# EAGLE design vco1_components (EAGLE 7.6.0)
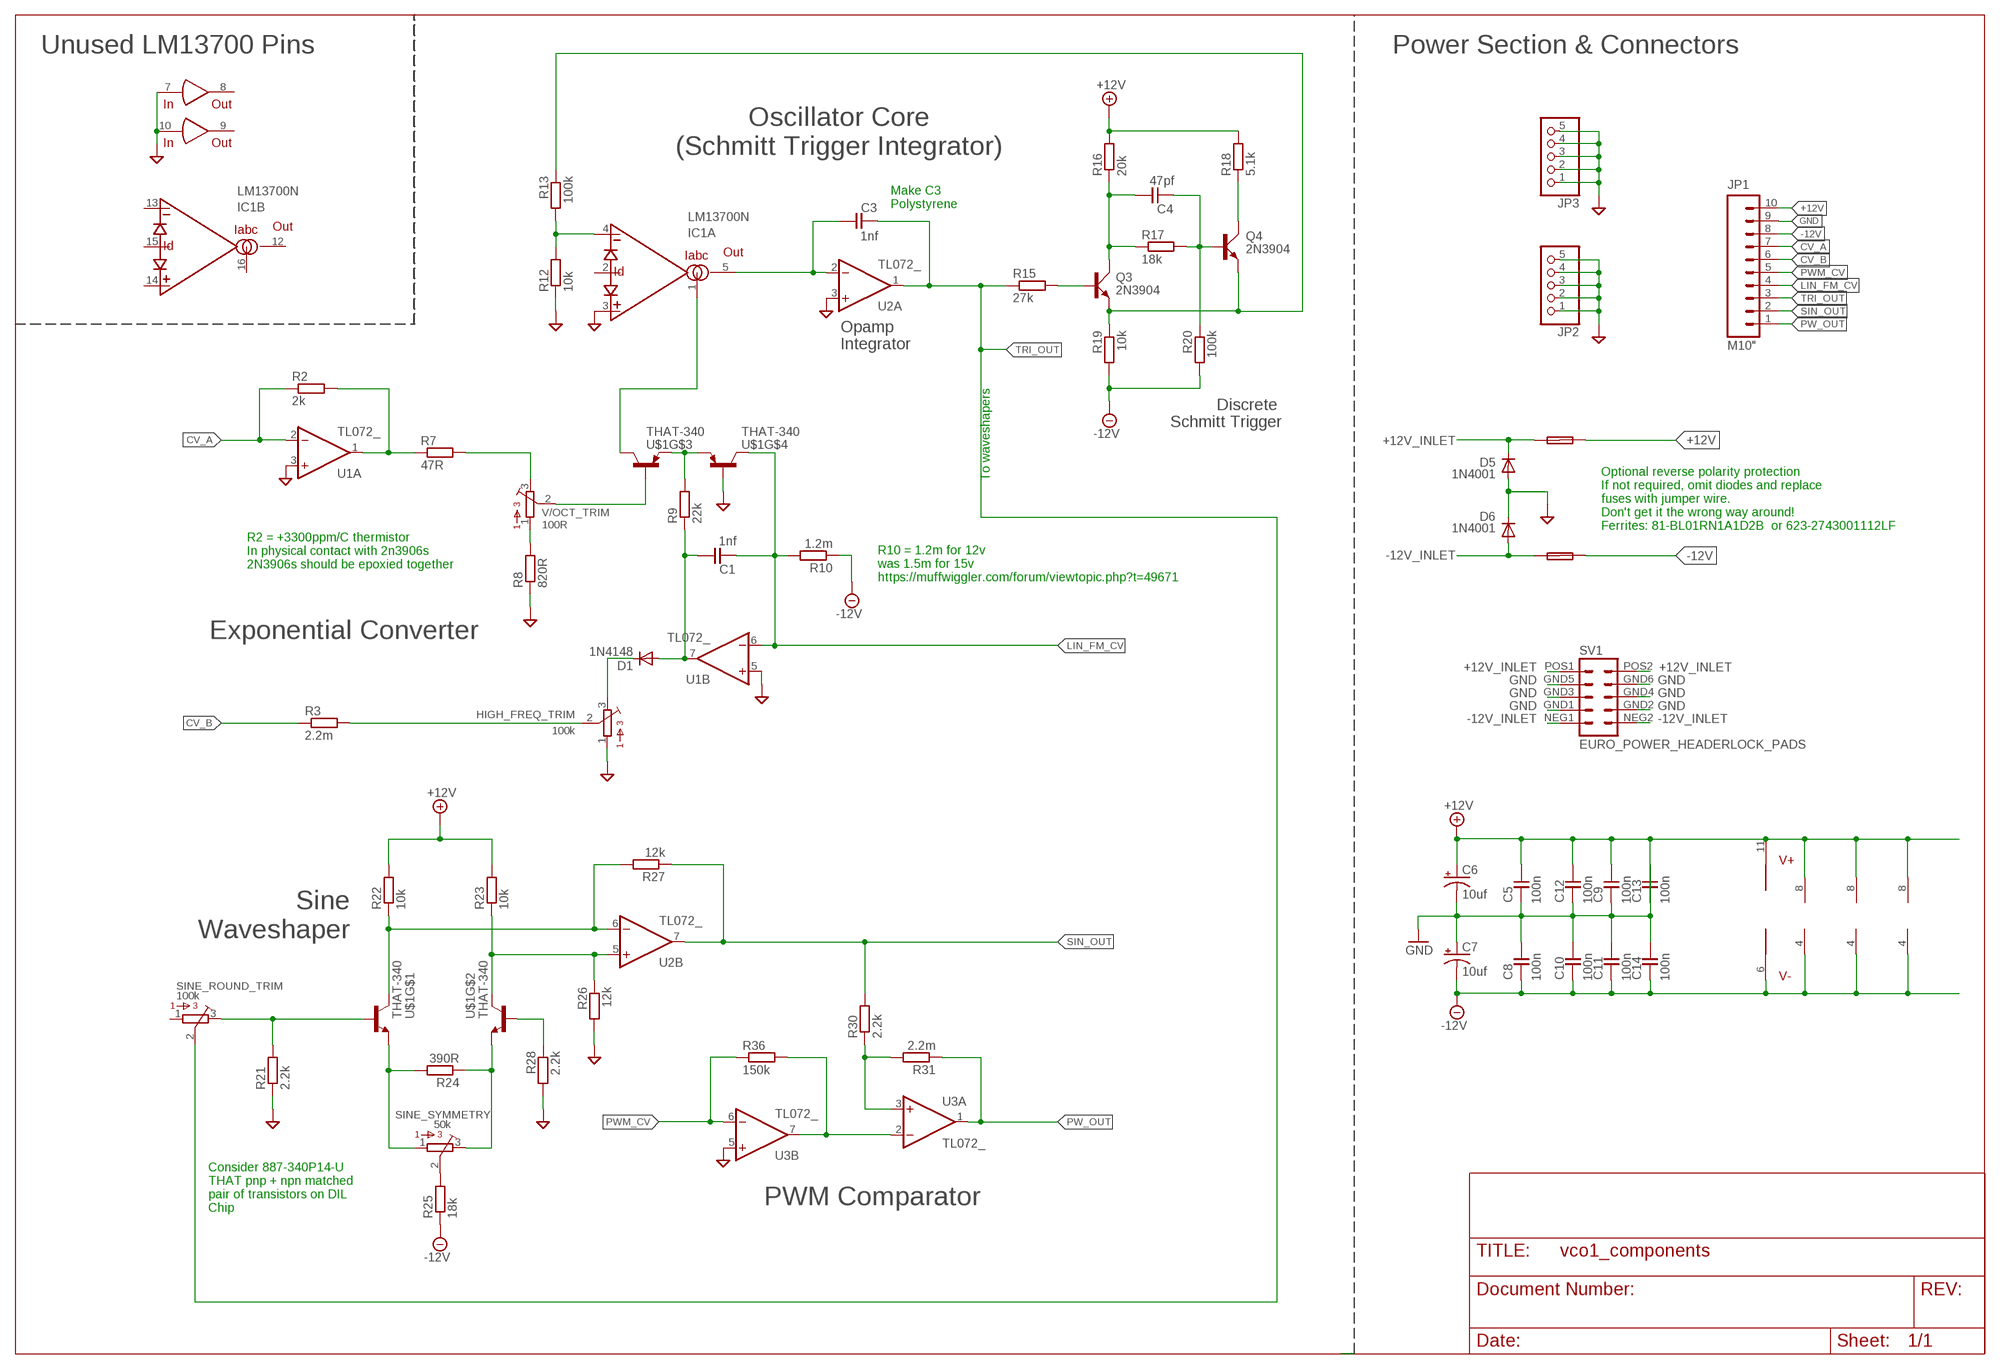
[diagram p0: schematic, sheet 1]

## Parts
C1  1nf  C-EU050-024X044  [C050-024X044]
C3  1nf  C-EU050-024X044  [C050-024X044]
C4  47pf  C-EU050-024X044  [C050-024X044]
C5  100n  C-EU050-024X044  [C050-024X044]
C6  10uf  CAP_POLPTH2  [CPOL-RADIAL-10UF-25V]
C7  10uf  CAP_POLPTH2  [CPOL-RADIAL-10UF-25V]
C8  100n  C-EU050-024X044  [C050-024X044]
C9  100n  C-EU050-024X044  [C050-024X044]
C10  100n  C-EU050-024X044  [C050-024X044]
C11  100n  C-EU050-024X044  [C050-024X044]
C12  100n  C-EU050-024X044  [C050-024X044]
C13  100n  C-EU050-024X044  [C050-024X044]
C14  100n  C-EU050-024X044  [C050-024X044]
D1  1N4148  SMALL_DIODEDO35-7  [DO35-7]
D5  1N4001  1N4004  [DO41-10]
D6  1N4001  1N4004  [DO41-10]
F1  FUSE  PTC_FUSEPOLY_FUSE  [C050H075X075]
F2  FUSE  PTC_FUSEPOLY_FUSE  [C050H075X075]
HIGH_FREQ_TRIM  100k  BOURNS_3362P_TRIMMERP  [BOURNS_3362P_TRIMMER]
IC1  LM13700N  [DIL16]
JP1  M10"  [1X10]
JP2  PINHD-1X55X2MM  [1_05X2MM]
JP3  PINHD-1X55X2MM  [1_05X2MM]
Q3  2N3904  [TO92D]
Q4  2N3904  [TO92D]
R2  2k  RESISTOR7MM  [7MM_RESISTOR]
R3  2.2m  RESISTOR7MM  [7MM_RESISTOR]
R7  47R  RESISTOR7MM  [7MM_RESISTOR]
R8  820R  RESISTOR7MM  [7MM_RESISTOR]
R9  22k  RESISTOR7MM  [7MM_RESISTOR]
R10  1.2m  RESISTOR7MM  [7MM_RESISTOR]
R12  10k  RESISTOR7MM  [7MM_RESISTOR]
R13  100k  RESISTOR7MM  [7MM_RESISTOR]
R15  27k  RESISTOR7MM  [7MM_RESISTOR]
R16  20k  RESISTOR7MM  [7MM_RESISTOR]
R17  18k  RESISTOR7MM  [7MM_RESISTOR]
R18  5.1k  RESISTOR7MM  [7MM_RESISTOR]
R19  10k  RESISTOR7MM  [7MM_RESISTOR]
R20  100k  RESISTOR7MM  [7MM_RESISTOR]
R21  2.2k  RESISTOR7MM  [7MM_RESISTOR]
R22  10k  RESISTOR7MM  [7MM_RESISTOR]
R23  10k  RESISTOR7MM  [7MM_RESISTOR]
R24  390R  RESISTOR7MM  [7MM_RESISTOR]
R25  18k  RESISTOR7MM  [7MM_RESISTOR]
R26  12k  RESISTOR7MM  [7MM_RESISTOR]
R27  12k  RESISTOR7MM  [7MM_RESISTOR]
R28  2.2k  RESISTOR7MM  [7MM_RESISTOR]
R30  2.2k  RESISTOR7MM  [7MM_RESISTOR]
R31  2.2m  RESISTOR7MM  [7MM_RESISTOR]
R36  150k  RESISTOR7MM  [7MM_RESISTOR]
SINE_ROUND_TRIM  100k  BOURNS_3362P_TRIMMERP  [BOURNS_3362P_TRIMMER]
SINE_SYMMETRY  50k  BOURNS_3362P_TRIMMERP  [BOURNS_3362P_TRIMMER]
SV1  EURO_POWER_HEADERLOCK_PADS  [EURO_PWR_HEADER_LOCK]
U1  TL072_  [DIL08]
U2  TL072_  [DIL08]
U3  TL072_  [DIL08]
U$1  THAT-340  THAT-340THRUHOLE  [DIL14]
V/OCT_TRIM  100R  BOURNS_3362P_TRIMMERP  [BOURNS_3362P_TRIMMER]

## Nets
+12V: C5.1 C6.1(+) C9.1 C12.1 C13.2 F1.2 IC1.11(V+) JP1.10 R16.2 R18.2 R22.2 R23.2 U1.8(P:V+) U2.8(P:V+) U3.8(P:V+)
+12V_INLET [power]: D5.C F1.1 SV1.POS1 SV1.POS2
-12V: C7.2(-) C8.2 C10.2 C11.2 C14.2 F2.2 IC1.6(V-) JP1.8 R10.1 R19.2 R20.2 R25.1 U1.4(P:V-) U2.4(P:V-) U3.4(P:V-)
-12V_INLET [power]: D6.A F2.1 SV1.NEG1 SV1.NEG2
CV_A: JP1.7 R2.1 U1.2(A:-IN)
CV_B: JP1.6 R3.1
GND: C5.2 C6.2(-) C7.1(+) C8.1 C9.2 C10.1 C11.1 C12.2 C13.1 C14.1 D5.A D6.C HIGH_FREQ_TRIM.1 IC1.3(A:+IN) IC1.7(IN) IC1.10(IN) JP1.9 JP2.1 JP2.2 JP2.3 JP2.4 JP2.5 JP3.1 JP3.2 JP3.3 JP3.4 JP3.5 R8.1 R12.1 R21.1 R26.2 R28.2 SV1.GND1 SV1.GND2 SV1.GND3 SV1.GND4 SV1.GND5 SV1.GND6 U1.3(A:+IN) U1.5(B:+IN) U2.3(A:+IN) U3.5(B:+IN) U$1.9(B)
LIN_FM_CV: C1.2 JP1.4 R10.2 U1.6(B:-IN) U$1.8(C)
N$7: R2.2 R7.1 U1.1(A:OUT)
N$8: R7.2 V/OCT_TRIM.3
N$9: R8.2 V/OCT_TRIM.1
N$10: U$1.6(B) V/OCT_TRIM.2
N$11: R9.2 U$1.5(E) U$1.10(E)
N$12: IC1.1(A:IABC) U$1.7(C)
N$13: C1.1 D1.A R9.1 U1.7(B:OUT)
N$15: D1.C HIGH_FREQ_TRIM.3
N$16: HIGH_FREQ_TRIM.2 R3.2
N$21: IC1.4(A:-IN) R12.2 R13.2
N$22: C3.1 IC1.5(A:OUT) U2.2(A:-IN)
N$24: Q3.B R15.2
N$25: C4.1 Q3.C R16.1 R17.1
N$26: R21.2 SINE_ROUND_TRIM.3 U$1.2(B)
N$27: C4.2 Q4.B R17.2 R20.1
N$28: Q4.C R18.1
N$29: R25.2 SINE_SYMMETRY.2
N$30: Q3.E Q4.E R13.1 R19.1
N$31: R22.1 R27.2 U2.6(B:-IN) U$1.1(C)
N$32: R23.1 R26.1 U2.5(B:+IN) U$1.14(C)
N$33: R24.2 SINE_SYMMETRY.1 U$1.3(E)
N$34: R24.1 SINE_SYMMETRY.3 U$1.12(E)
N$35: R28.1 U$1.13(B)
N$38: R30.1 R31.2 U3.3(A:+IN)
N$40: R36.2 U3.2(A:-IN) U3.7(B:OUT)
PW_OUT: JP1.1 R31.1 U3.1(A:OUT)
PWM_CV: JP1.5 R36.1 U3.6(B:-IN)
SIN_OUT: JP1.2 R27.1 R30.2 U2.7(B:OUT)
TRI_OUT: C3.2 JP1.3 R15.1 SINE_ROUND_TRIM.2 U2.1(A:OUT)
Unconnected: IC1.2(A:ID) IC1.8(OUT) IC1.9(OUT) IC1.12(B:OUT) IC1.13(B:-IN) IC1.14(B:+IN) IC1.15(B:ID) IC1.16(B:IABC) SINE_ROUND_TRIM.1

## Notes on the sheet
- Unused LM13700 Pins | Power Section & Connectors
- Oscillator Core
  (Schmitt Trigger Integrator)
- Make C3 
  Polystyrene
- Opamp
  Integrator
- To waveshapers
- Discrete 
  Schmitt Trigger
- Optional reverse polarity protection
  If not required, omit diodes and replace
  fuses with jumper wire. 
  Don't get it the wrong way around! 
  Ferrites: 81-BL01RN1A1D2B  or 623-2743001112LF
- R2 = +3300ppm/C thermistor
  In physical contact with 2n3906s
  2N3906s should be epoxied together
- R10 = 1.2m for 12v
  was 1.5m for 15v
  https://muffwiggler.com/forum/viewtopic.php?t=49671
- Exponential Converter
- Sine
  Waveshaper
- PWM Comparator
- Consider 887-340P14-U
  THAT pnp + npn matched
  pair of transistors on DIL 
  Chip

## Library data of the parts
C1 C3-C5 C8-C14 = TomW:C-EU: CAPACITOR, European symbol
C6 C7 = SparkFun-Passives:CAP_POL: Capacitor Polarized These are standard SMD and PTH capacitors. Normally 10uF, 47uF, and 100uF in electrolytic and tantalum varieties. Always verify the external diameter of the through hole cap, it varies with capacity, voltage, and manufacturer. The EIA devices should be standard.
D1 = MusicThingModular:SMALL_DIODE: Small Signal Diode
D5 D6 = diode:1N4004: DIODE general purpose rectifier, 1 A
F1 F2 = TomW:PTC_FUSE
HIGH_FREQ_TRIM SINE_ROUND_TRIM SINE_SYMMETRY V/OCT_TRIM = MusicThingModular:BOURNS_3362P_TRIMMER: 3362 Series 1/4" Square Trimmer
IC1 = synthdiy:LM13700: National Dual OTA with buffers.
JP1 = SparkFun-Connectors:M10: Header 10 Standard 10-pin 0.1" header. Use with straight break away headers (SKU : PRT-00116), right angle break away headers (PRT-00553), swiss pins (PRT-00743), machine pins (PRT-00117), and female headers (PRT-00115).
JP2 JP3 = pinhead:PINHD-1X5: PIN HEADER
Q3 Q4 = transistor-small-signal:2N3904: NPN TRANSISTOR
R2 R3 R7-R10 R12 R13 R15-R28 R30 R31 R36 = MusicThingModular:RESISTOR: Standard resistor, various versions
SV1 = MusicThingModular:EURO_POWER_HEADER: Power Header 10 pin power header for Eurorack Power Supplies Variants with fatter pads for easier soldering, and the LOCK variant which has 5mil offset pins to hold the component in place before soldering
U1-U3 = MusicThingModular:TL072: Generic Dual Op Amp
U$1 = MusicThingModular:THAT-340

## Net classes
1 power: width 0.406 mm
2 ground: width 0.305 mm

## Board
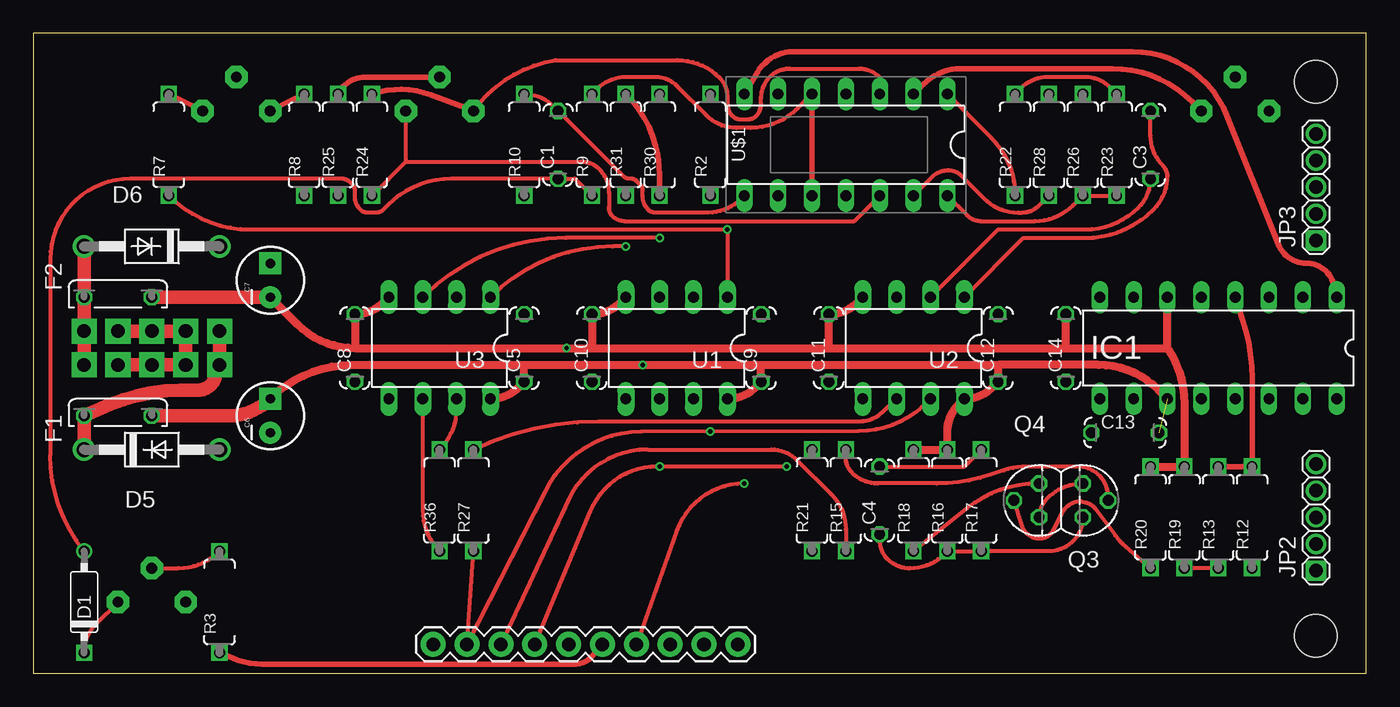
[diagram p1: board, top side]
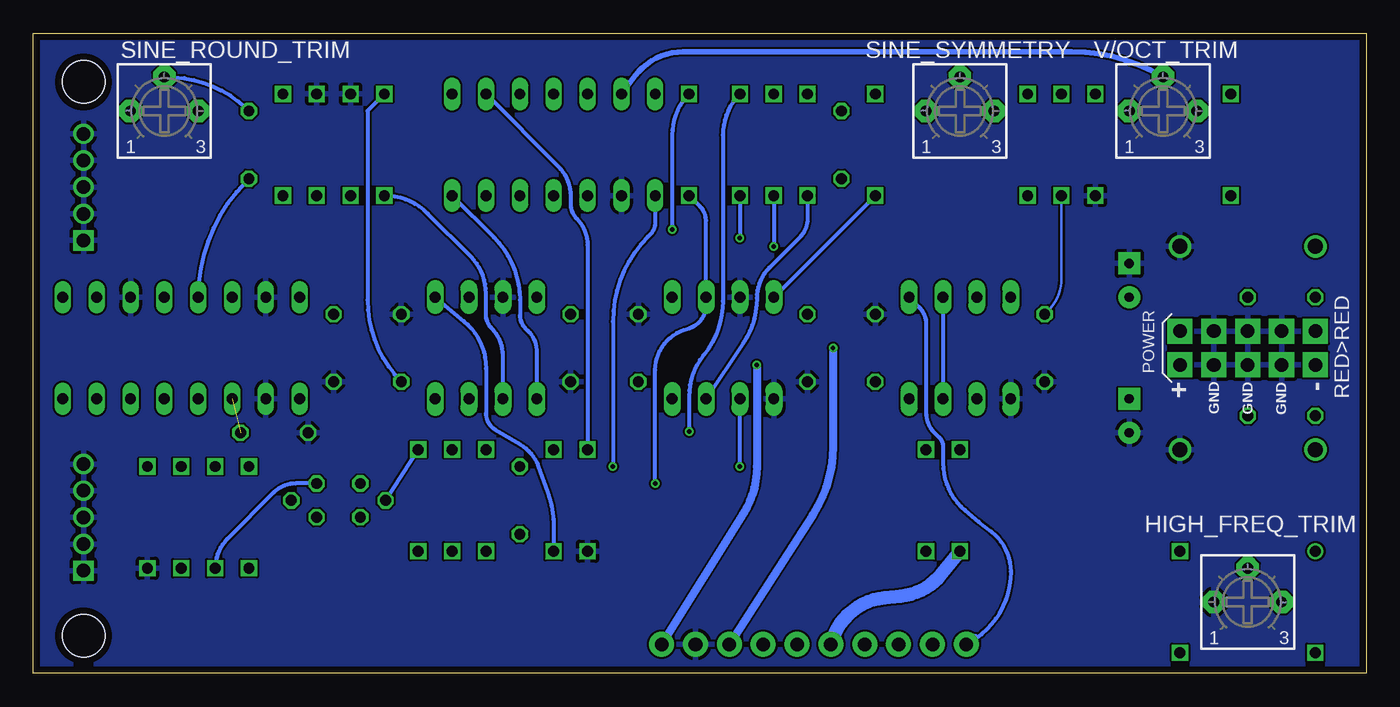
[diagram p2: board, bottom side, seen from below]

Size 100 x 48 mm. Coordinates in mm from the lower left corner, seen from the top.
Outline: 0,0 100,0 100,48 0,48 0,0
Copper layers (1*16): Top 0.035mm / dielectric 1.6mm / Bottom 0.035mm
Design rules "Elecrow_2-layer_PCB_eagle_rule": minimum track width 6mil, minimum drill 12mil, track to track 6mil, track to pad 6mil, pad to pad 6mil, via to via 8mil, smd to smd 0mil, copper to edge 20mil, drill to drill 10mil, minimum pad ring 6mil, minimum via ring 6mil, stop-mask expansion 0mil, vias tented up to drill 100mil, thermal gap 10mil
Holes 3.2 mm at 96.23,44.35 96.23,2.81

### Footprints (pad centres in the part's own frame; a part is rotated, then mirrored left to right if it is on the bottom)
C050-024X044 = drill 0.813 octagon: 1 -2.54,0; 2 2.54,0
CPOL-RADIAL-10UF-25V = drill 0.7 pad 1.651 square: 1 1.27,0 | drill 0.7 pad 1.651: 2 -1.27,0
DO35-7 = drill 0.813: A 3.81,0 | drill 0.813 square: C -3.81,0
DO41-10 = drill 1.118: A 5.08,0; C -5.08,0
C050H075X075 = drill 0.813 octagon: 1 -2.54,0; 2 2.54,0
BOURNS_3362P_TRIMMER = drill 0.813 pad 1.676 octagon: 1 -2.54,0; 2 0,2.54; 3 2.54,0
DIL16 = drill 0.813 long: 1 -8.89,-3.81; 2 -6.35,-3.81; 3 -3.81,-3.81; 4 -1.27,-3.81; 5 1.27,-3.81; 6 3.81,-3.81; 7 6.35,-3.81; 8 8.89,-3.81; 9 8.89,3.81; 10 6.35,3.81; 11 3.81,3.81; 12 1.27,3.81; 13 -1.27,3.81; 14 -3.81,3.81; 15 -6.35,3.81; 16 -8.89,3.81
1X10 = drill 1.016 pad 1.88: 1 0,0; 2 2.54,0; 3 5.08,0; 4 7.62,0; 5 10.16,0; 6 12.7,0; 7 15.24,0; 8 17.78,0; 9 20.32,0; 10 22.86,0
1_05X2MM = drill 1.016 pad 1.3 square: 1 -4,0 | drill 1.016 pad 1.3: 2 0,0; 3 -2,0; 4 2,0; 5 4,0
TO92D = drill 0.813 octagon: B 0,1.905; C 1.27,0; E -1.27,0
7MM_RESISTOR = drill 0.813 square: 1 -3.81,0; 2 3.81,0
EURO_PWR_HEADER_LOCK = drill 1.016 pad 1.88 square: GND1 -2.54,1.27; GND2 -2.54,-1.27; GND3 0,1.27; GND4 0,-1.27; GND5 2.54,1.27; GND6 2.54,-1.27; NEG1 -5.08,1.27; NEG2 -5.08,-1.27; POS1 5.08,1.27; POS2 5.08,-1.27
DIL08 = drill 0.813 pad 1.27 long: 1 -3.81,-3.81; 2 -1.27,-3.81; 3 1.27,-3.81; 4 3.81,-3.81; 5 3.81,3.81; 6 1.27,3.81; 7 -1.27,3.81; 8 -3.81,3.81
DIL14 = drill 0.813 long: 1 -7.62,-3.81; 2 -5.08,-3.81; 3 -2.54,-3.81; 4 0,-3.81; 5 2.54,-3.81; 6 5.08,-3.81; 7 7.62,-3.81; 8 7.62,3.81; 9 5.08,3.81; 10 2.54,3.81; 11 0,3.81; 12 -2.54,3.81; 13 -5.08,3.81; 14 -7.62,3.81

### Placement (x,y rotation side)
C1  39.37,39.64 90 top
C3  83.82,39.64 90 top
C4  63.5,12.97 90 top
C5  36.83,24.4 90 top
C6  17.78,19.32 90 top
C7  17.78,29.48 90 top
C8  24.13,24.4 90 top
C9  54.61,24.4 90 top
C10  41.91,24.4 90 top
C11  59.69,24.4 90 top
C12  72.39,24.4 90 top
C13  81.92,18.05 0 top
C14  77.47,24.4 90 top
D1  3.81,5.35 90 top
D5  8.89,16.78 0 top
D6  8.89,32.02 180 top
F1  6.35,19.32 0 top
F2  6.35,28.21 0 top
HIGH_FREQ_TRIM  8.89,5.35 0 bottom
IC1  88.9,24.4 180 top
JP1  30,2.17 0 top
JP2  96.23,11.7 90 top
JP3  96.23,36.47 90 top
Q3  78.74,12.97 270 top
Q4  75.47,12.97 90 top
R2  50.8,39.64 90 top
R3  13.97,5.35 90 top
R7  10.16,39.64 90 top
R8  20.32,39.64 90 top
R9  41.91,39.64 90 top
R10  36.83,39.64 90 top
R12  91.44,11.7 90 top
R13  88.9,11.7 90 top
R15  60.96,12.97 90 top
R16  68.58,12.97 90 top
R17  71.12,12.97 90 top
R18  66.04,12.97 90 top
R19  86.36,11.7 90 top
R20  83.82,11.7 90 top
R21  58.42,12.97 90 top
R22  73.66,39.64 90 top
R23  81.28,39.64 90 top
R24  25.4,39.64 90 top
R25  22.86,39.64 90 top
R26  78.74,39.64 90 top
R27  33.02,12.97 90 top
R28  76.2,39.64 90 top
R30  46.99,39.64 90 top
R31  44.45,39.64 90 top
R36  30.48,12.97 90 top
SINE_ROUND_TRIM  90.17,42.18 0 bottom
SINE_SYMMETRY  30.48,42.18 0 bottom
SV1  8.89,24.4 180 bottom
U1  48.26,24.4 180 top
U2  66.04,24.4 180 top
U3  30.48,24.4 180 top
U$1  60.96,39.64 180 top
V/OCT_TRIM  15.24,42.18 0 bottom

### Tracks (layer width: path | path; a pad name or v marks a point on that pad's centre or on a via)
+12V  (via drill 0.33)  (1 unrouted)
  Top 0.305: R23.2 80.78,43.95 arc45 78.93,44.72 76.11,44.72 arc45 74.1,43.89 R22.2
  Top 0.61: C6.1 arc-45 23.91,23.13 36.83,23.13 | 36.83,23.13 v45.72,23.13 54.61,23.13 | 54.61,23.13 72.39,23.13 | IC1.11 84.41,21.27 arc45 79.92,23.13 72.39,23.13 | U3.8 arc45 36.46,21.49 C5.1 36.83,23.13 | U1.8 arc45 54.24,21.49 C9.1 54.61,23.13 | 72.39,23.13 C12.1 72.02,21.49 arc-45 U2.8 69.41,20.15 arc45 68.58,18.14 R16.2 R18.2
  Top 1.016: F1.2 14.71,19.32 arc45 C6.1
  Bottom 0.305: R22.2 74.93,42.18 74.93,27.99 arc-45 C12.1
  Bottom 0.61: v45.72,23.13 45.72,15.51 arc32 46.73,11.99 JP1.10
+12V_INLET
  Top 1.016: SV1.POS2 SV1.POS1 13.66,22.2 arc-72 12.31,21.23 11.03,21.23 arc23 5.71,20.13 F1.1 D5.C
-12V  (via drill 0.33)
  Top 0.61: C7.2 19.79,26.2 arc45 24.13,24.4 | 24.13,24.4 v40.01,24.4 41.91,24.4 | 41.91,24.4 59.69,24.4 | 59.69,24.4 77.47,24.4 | 77.47,24.4 85.09,24.4 | 85.09,24.4 IC1.6 | 24.13,24.4 C8.2 arc45 26.3,27.84 U3.4 | 41.91,24.4 C10.2 arc45 44.08,27.84 U1.4 | R20.2 R19.2 86.36,20.2 arc34 85.09,24.4 | 59.69,24.4 C11.2 arc45 61.86,27.84 U2.4 | 77.47,24.4 C14.2
  Top 1.016: F2.2 C7.2
  Bottom 0.203: R25.1 22.86,29.63 arc45 23.86,27.21 C8.2
  Bottom 0.305: R10.1 U1.4
  Bottom 0.61: v40.01,24.4 40.01,17.02 arc33 41.51,11.9 JP1.8
-12V_INLET
  Top 1.016: D6.A F2.1 SV1.NEG2 SV1.NEG1
CV_A  (via drill 0.33)
  Top 0.305: v53.34,14.24 arc70 48.25,10.65 JP1.7
  Bottom 0.305: v53.34,14.24 53.34,22.75 arc72 51.17,25.76 50.76,25.9 arc-72 49.53,27.6 U1.2 49.53,33.97 arc-45 49.95,34.98 R2.1
CV_B
  Top 0.406: R3.1 14.91,1.15 arc22 17.18,0.7 40.66,0.7 arc49 41.89,1.25 JP1.6
GND
  Top 1.016: SV1.GND1 SV1.GND3 SV1.GND5 SV1.GND6 | SV1.GND6 SV1.GND4 | SV1.GND6 SV1.GND2
  pour Bottom: -3.81,-1.27 107.95,-1.27 107.95,54.61 -3.81,54.61
LIN_FM_CV  (via drill 0.33)
  Top 0.305: R10.2 arc-45 39,42.55 C1.2 44.26,37.29 arc45 44.71,37.1 44.82,37.1 arc-45 45.27,36.91 45.53,36.65 arc-45 45.72,36.2 45.72,35.78 arc45 46.14,34.78 46.17,34.75 arc45 46.62,34.56 50.65,34.56 arc45 53.07,35.56 U$1.8 | v56.52,15.51 v46.99,15.51 46.82,15.51 arc67 41.78,12.15 JP1.4
  Bottom 0.305: v46.99,15.51 U1.6 | U$1.8 53.34,33.82 arc45 53.71,32.92 53.88,32.74 arc-45 56.52,26.39 v56.52,15.51
N$7  (via drill 0.33)
  Top 0.305: R7.1 arc45 16.29,33.29 v52.07,33.29 U1.1
  Bottom 0.305: R2.2 arc-45 52.07,40.38 v52.07,33.29
N$8
  Top 0.406: R7.2 V/OCT_TRIM.3
N$9
  Top 0.406: V/OCT_TRIM.1 R8.2
N$10
  Bottom 0.406: V/OCT_TRIM.2 arc-31 22.12,46.62 48.51,46.62 arc0 48.52,46.62 51.27,46.61 arc-53 54.85,44.82 U$1.6
N$11
  Top 0.305: U$1.5 57.33,42.36 arc-45 53.83,40.91 52.75,40.91 arc-45 50.51,41.84 48.3,44.05 arc45 46.68,44.72 44.49,44.72 arc45 42.25,43.79 R9.2
  Top 0.406: U$1.10 U$1.5
N$12
  Top 0.406: U$1.7 54.32,45.08 arc-59 57.04,46.62 82.45,46.62 arc-68 89.55,41.82 93.4,32.19 arc68 95.53,30.75 arc-76 97.55,29.17 IC1.1
N$13
  Top 0.305: D1.A arc-39 1.27,16.4 1.27,31.08 arc-90 7.29,37.1 23.12,37.1 arc-45 23.76,36.84 23.94,36.65 arc-45 24.13,36.2 24.13,35.72 arc45 24.5,34.82 24.58,34.75 arc45 25.03,34.56 25.77,34.56 arc45 26.22,34.75 26.6,35.12 arc-45 31.37,37.1 C1.1 40.64,37.1 R9.1
  Bottom 0.305: R9.1 41.91,34.12 arc45 42.5,32.7 44.77,30.43 arc-45 45.72,28.14 arc34 46.74,24.78 U1.7
N$15
  Top 0.305: D1.C arc-45 4.71,3.71 HIGH_FREQ_TRIM.3
N$16
  Top 0.305: HIGH_FREQ_TRIM.2 10.9,7.89 arc45 R3.2
N$21
  Top 0.406: R13.2 R12.2 91.44,22.12 arc18 90.72,26.56 IC1.4
N$22
  Top 0.305: U2.2 72.39,33.29 78.96,33.29 arc45 82.92,34.93 arc45 C3.1
  Bottom 0.305: C3.1 84.04,36.88 arc-45 IC1.5
N$24
  Top 0.305: R15.2 60.96,16.19 arc45 61.44,15.03 arc45 63.35,14.24 67.78,14.24 arc18 71.81,14.89 72.82,15.23 arc-18 74.55,15.51 78.36,15.51 arc-90 80.64,13.22 Q3.B
N$25
  Top 0.305: C4.1 63.5,9.95 arc45 64.06,8.6 arc45 65.78,7.89 arc45 68.39,8.97 R16.1 R17.1 76.2,9.16 arc90 Q3.C
N$26
  Top 0.406: U$1.2 66.77,44.18 arc-45 69.61,45.35 80.92,45.35 arc-45 86.96,42.85 SINE_ROUND_TRIM.3
  Bottom 0.305: U$1.2 60.64,38.05 arc45 59.69,35.76 59.69,35.18 arc-45 59.25,34.12 arc45 58.42,32.11 R21.2
N$27
  Top 0.305: C4.2 69.85,15.51 R17.2 | Q4.B 74.19,11.04 arc72 75.49,10.1 arc63 76.52,10.74 77.14,11.98 arc-63 78.62,12.9 78.99,12.8 arc-39 79.65,12.36 81.16,10.35 arc12 81.92,9.53 R20.1
  Bottom 0.305: Q4.B R17.2
N$28
  Top 0.305: Q4.C 75.38,14.24 arc39 70.06,12.37 R18.1
N$29
  Top 0.406: SINE_SYMMETRY.2 24.91,44.72 arc63 R25.2
N$30
  Top 0.305: R13.1 R19.1 | Q4.E arc-50 76.28,13.32 76.46,13.46 arc-37 78.59,14.24 Q3.E
  Bottom 0.305: Q3.E 80.33,14.24 arc-45 81.95,13.57 85.46,10.06 arc-45 R19.1
N$31
  Top 0.305: U$1.1 71.86,40.17 arc-45 R22.1 | U2.6 63.62,19.52 arc-43 62.02,18.89 42.44,18.89 arc25 R27.2
  Bottom 0.305: U2.6 64.77,23.86 arc-45 65.6,25.87 arc45 66.04,26.93 66.04,28.52 arc-45 67.17,31.25 70.41,34.48 arc-45 R22.1
N$32
  Top 0.305: U$1.14 70.07,34.34 arc45 71.07,33.92 75.15,33.92 arc45 78.03,35.12 R26.1 R23.1
  Bottom 0.305: U$1.14 65.44,32.69 arc45 63.5,28 63.5,26.83 arc-45 63.13,25.93 62.9,25.71 arc45 62.23,24.09 U2.5
N$33
  Top 0.305: SINE_SYMMETRY.1 arc-45 39.15,45.99 48.3,45.99 arc-45 51.48,44.67 arc-45 52.07,43.25 52.07,42.71 arc45 52.44,41.81 arc45 53.08,41.55 53.6,41.55 arc45 54.24,41.81 arc45 54.61,42.71 54.61,43.14 arc-45 55.28,44.76 55.29,44.77 arc-45 56.71,45.35 61.97,45.35 arc-45 63.5,44.72 U$1.3
  Top 0.406: SINE_SYMMETRY.1 29.8,43.39 arc35 26.01,43.6 R24.2
N$34
  Top 0.305: 27.94,38.37 41.17,38.37 arc-45 42.44,37.84 arc-45 43.18,36.05 43.18,34.93 arc45 43.44,34.3 arc45 44.34,33.92 61.59,33.92 U$1.12 | 27.94,38.37 R24.1 | SINE_SYMMETRY.3 27.94,38.37
N$35
  Top 0.305: U$1.13 67.46,37.25 arc-45 68.63,37.73 arc-45 69.63,37.32 71.34,35.61 arc45 73.88,34.56 74.19,34.56 arc45 75.46,35.09 R28.1
N$38  (via drill 0.33)
  Top 0.305: v46.99,32.66 39.94,32.66 arc45 U3.3
  Top 0.406: R30.1 46.99,37.32 arc45 R31.2
  Bottom 0.305: R30.1 v46.99,32.66
N$40
  Top 0.305: U3.7 31.75,19.85 arc-45 R36.2
  Bottom 0.305: U3.2 U3.7
PW_OUT  (via drill 0.33)
  Top 0.305: v44.45,32.02 43.49,32.02 arc45 U3.1
  Bottom 0.305: R31.1 v44.45,32.02 | U3.1 33.55,27.47 arc45 33.02,26.2 33.02,19.52 arc-45 32.43,18.1 32.01,17.68 arc45 31.75,17.04 31.75,15.75 arc-50 30.1,12.23 29.08,11.38 28.12,10.63 arc52 26.67,7.62 arc60 29.75,2.32 JP1.1 29.31,2.81
PWM_CV
  Top 0.305: U3.6 29.21,12.23 arc45 R36.1
  Bottom 1.016: R36.1 31.82,7.49 arc46 34.94,5.79 36.11,5.68 arc-70 JP1.5
SIN_OUT  (via drill 0.33)
  Top 0.305: R27.1 JP1.2 38.38,13.61 arc-63 45.61,18.12 v50.8,18.15 61.94,18.19 arc46 67.12,20.4 U2.7
  Bottom 0.305: R30.2 arc-45 48.26,40.38 48.26,27.94 arc39 49.68,23.9 49.74,23.82 arc-39 50.8,20.8 v50.8,18.15
TRI_OUT
  Top 0.305: R15.1 60.96,10.8 arc45 59.88,13.42 57.3,15.99 arc45 55.4,16.78 46.07,16.78 arc65 40.15,13.01 JP1.3 | U2.1 74.3,32.66 78.88,32.66 arc45 84.06,34.8 arc45 85.09,37.28 arc45 84.77,38.06 arc-45 83.82,40.35 C3.2
  Bottom 0.305: SINE_ROUND_TRIM.2 arc45 84.04,42.4 C3.2 | U2.1 67.7,26.42 arc50 66.04,22.87 66.04,19.5 arc-60 65.34,18.27 63.46,17.17 arc40 62.12,15.55 61.41,13.59 arc20 60.96,11 R15.1